# Altium schematic sheet 15_Gigabit_Ethernet.SchDoc: C200
size 297 x 209 mm; Page Create Date: March  8, 1995; Page Number: 15; Page Size: A4; Comment: radxa_1010; Page Count: 21; RevCode: V1.11; Doc: 15_Gigabit_Ethernet; DsnPath: D:\WMS\C200\CC122\对外\C200 V1.11.DSN; SchematicName: c200; PageName: 15_Gigabit_Ethernet; PageSize: A4; TopSchematic: True
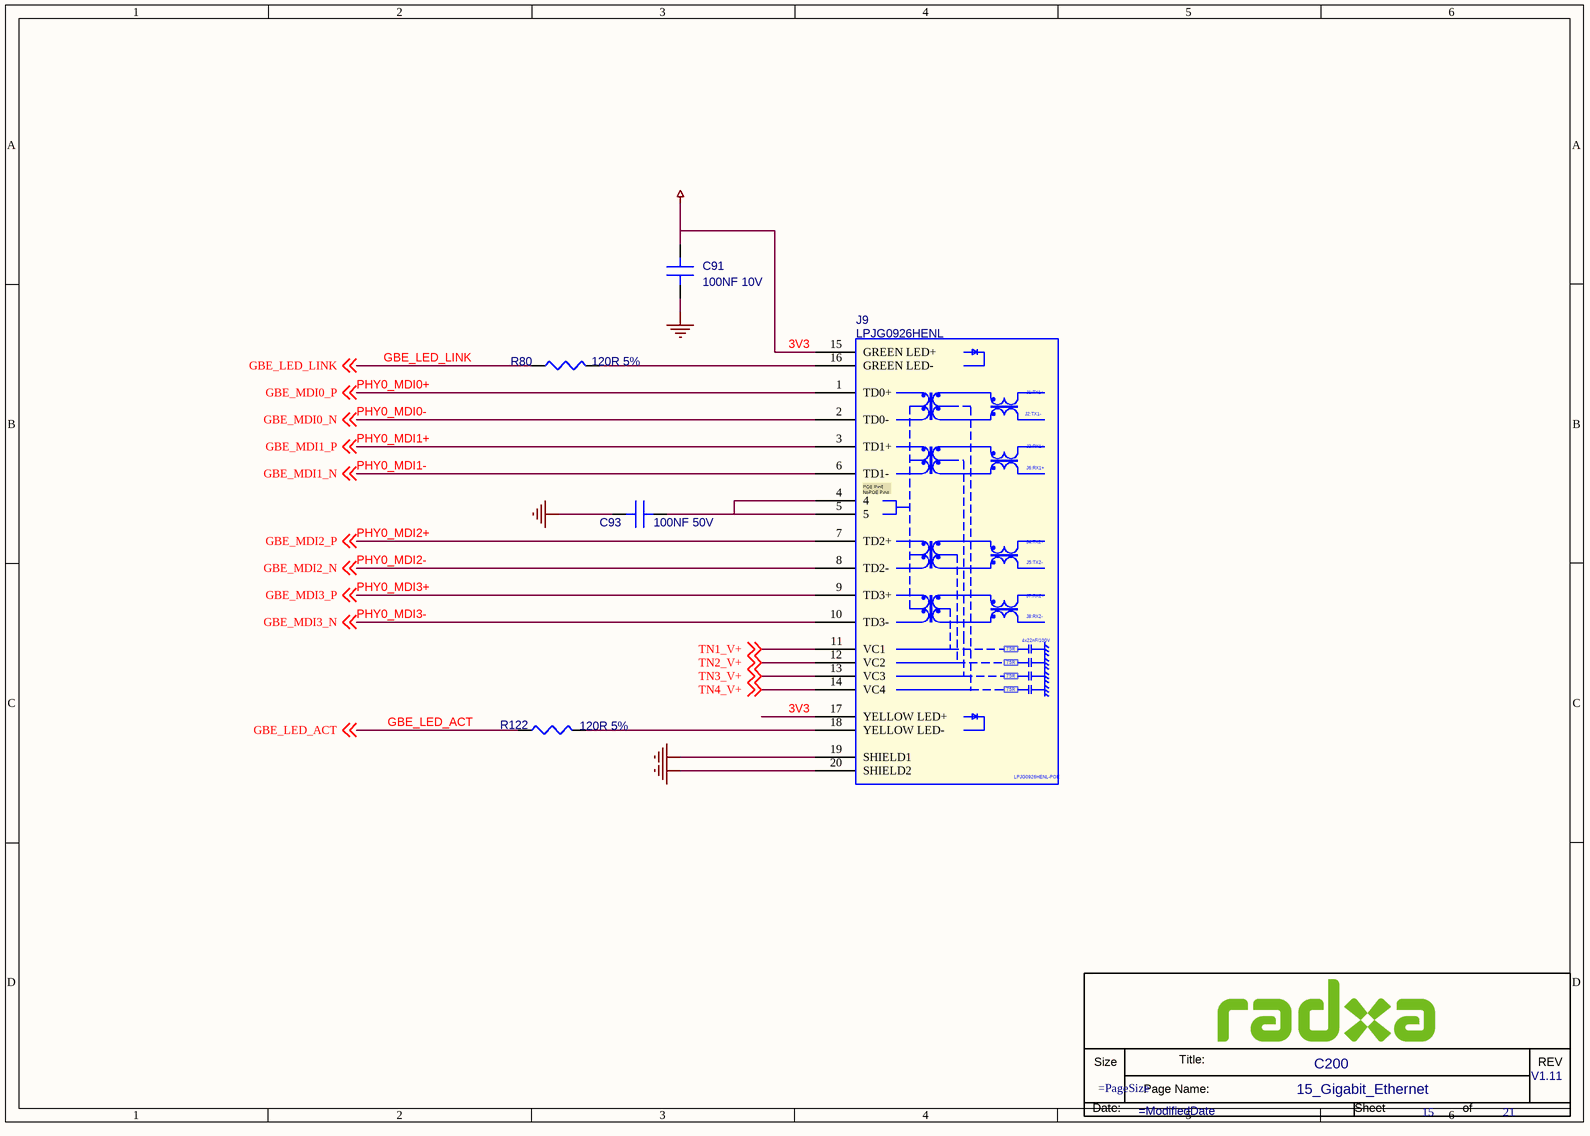
[diagram p0: 15_Gigabit_Ethernet.SchDoc]

## Parts
*  Doc: 15_Gigabit_Ethernet  RevCode: V1.11  Title: C200  Page Number: 15  Page Count: 21  (hidden comment: radxa_1010)  (graphical)
C91  100NF 10V  [C0201]
C93  100NF 50V  [C0201]
J9  LPJG0926HENL  [RJ45_LED_TH22_LIE]
R80  120R 5%  [R0402]
R122  120R 5%  [R0402]

## Nets
3V3: C91.2(B) J9.15(GREEN_LED+) J9.17(YELLOW_LED+)  [also labelled VDD_3V3_SYS]
GND: C91.1(A) C93.1(A) J9.19(SHIELD1) J9.20(SHIELD2)
GBE_LED_ACT: R122.1 ; off-sheet GBE_LED_ACT
GBE_LED_LINK: R80.1 ; off-sheet GBE_LED_LINK
PHY0_MDI0+: J9.1(TD0+) ; off-sheet GBE_MDI0_P  [also labelled GBE_MDI0_P]
PHY0_MDI0-: J9.2(TD0-) ; off-sheet GBE_MDI0_N  [also labelled GBE_MDI0_N]
PHY0_MDI1+: J9.3(TD1+) ; off-sheet GBE_MDI1_P  [also labelled GBE_MDI1_P]
PHY0_MDI1-: J9.6(TD1-) ; off-sheet GBE_MDI1_N  [also labelled GBE_MDI1_N]
PHY0_MDI2+: J9.7(TD2+) ; off-sheet GBE_MDI2_P  [also labelled GBE_MDI2_P]
PHY0_MDI2-: J9.8(TD2-) ; off-sheet GBE_MDI2_N  [also labelled GBE_MDI2_N]
PHY0_MDI3+: J9.9(TD3+) ; off-sheet GBE_MDI3_P  [also labelled GBE_MDI3_P]
PHY0_MDI3-: J9.10(TD3-) ; off-sheet GBE_MDI3_N  [also labelled GBE_MDI3_N]
TN1_V+: J9.11(VC1) ; off-sheet TN1_V+
TN2_V+: J9.12(VC2) ; off-sheet TN2_V+
TN3_V+: J9.13(VC3) ; off-sheet TN3_V+
TN4_V+: J9.14(VC4) ; off-sheet TN4_V+
NetC93_2: C93.2(B) J9.4 J9.5
NetJ9_16: J9.16(GREEN_LED-) R80.2
NetJ9_18: J9.18(YELLOW_LED-) R122.2

## Notes on the sheet
- (in symbol LPJG0926HENL) J1:TX1+; J2:TX1-; J3:RX1+; J6:RX1+; POE:Pin6 / NoPOE:Pin4; J4:TX2+; J5:TX2-; J7:RX2+; J8:RX2-; 4x22nF/100V; 75R; LPJG0926HENL-POE
- (in symbol radxa_1010) Size; Title:; REV; Page Name:; Date:; Sheet; of

## Library data of the parts
C91 = C: SMD  0201  100NF  10V  X5R  ±20%  ROHS; PARTS: 1; Part Reference: C91; Part Number: A1C01.00009; OriginalSymbolOrigin: (0,30); PKG_TYPE: CAP2-100-250; LEVEL: STD; PINSWAP: (A,B); Value: 100NF 10V; Part Type: 陶瓷电容; PCB Footprint: C0201
C93 = C: SMD  0201  100NF  50V  NPO  ±10%  ROHS; PARTS: 1; Part Reference: C93; Part Number: A1C01.00279; OriginalSymbolOrigin: (0,30); PKG_TYPE: CAP2-100-250; LEVEL: STD; PINSWAP: (A,B); Value: 100NF 50V; Part Type: 陶瓷电容; PCB Footprint: C0201
J9 = LPJG0926HENL: DIP  母座  千兆网  带POE功能  18PIN  21.5*16*13.7MM  LPJG0926HENL  镀镍  带指示灯  无弹片  左绿右黄  LP  ROHS; Part Reference: J9; Part Number: A1J03.00002; Parameter: 连接器-带POE功能的集成变压器RJ45; Value: LPJG0926HENL; Part Type: RJ45座; PCB Footprint: RJ45_LED_TH22_LIE
R80 = R: SMD  0201  120R  1/20W  ±5%  ROHS; Part Reference: R80; Part Number: A1R01.00091; PCB Footprint: R0201; Value: 120R 5%; Part Type: 贴片电阻
R122 = R: SMD  0201  120R  1/20W  ±5%  ROHS; Part Reference: R122; Part Number: A1R01.00091; PCB Footprint: R0201; Value: 120R 5%; Part Type: 贴片电阻
* = radxa_1010: Page Create Date: March  8, 1995; Page Size: =PageSize; Page Modify Date: =ModifiedDate